# Altium schematic sheet SC2.schdoc: TEBF0808 - CPLD_2
size A4; DocumentNumber: TEBF0808; Revision: 04; SheetNumber: 27; SheetTotal: 36; Date: 2016-09-29; CompanyName: Trenz Electronic GmbH; Organization: Trenz Electronic GmbH
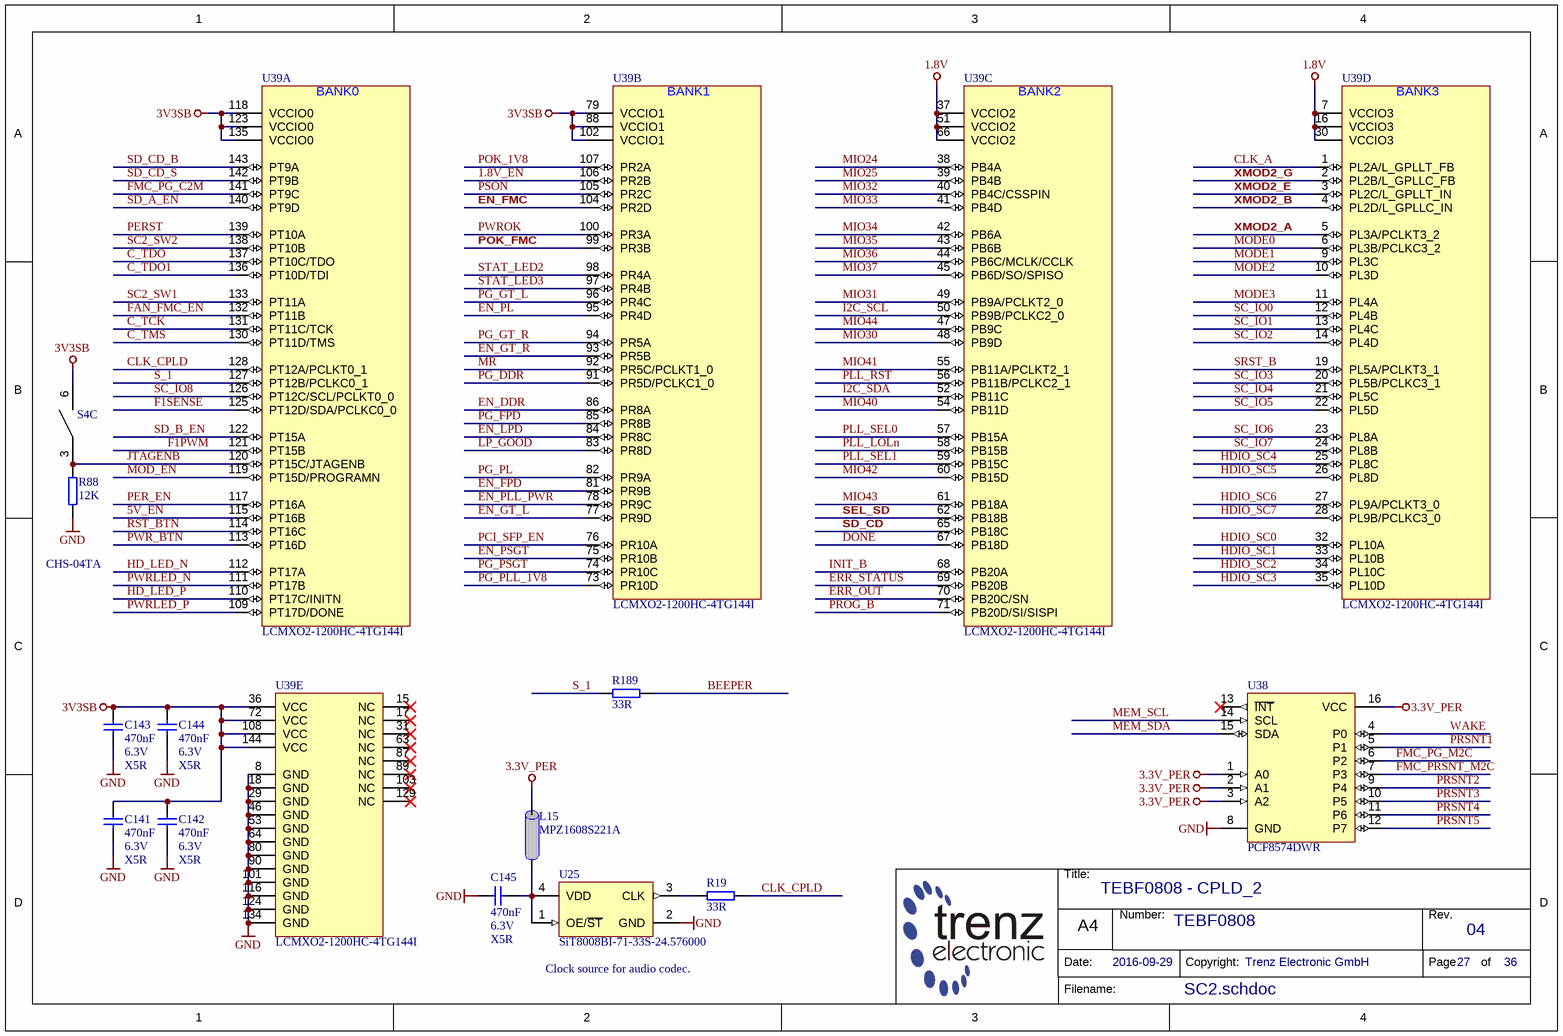
[diagram p0: SC2.schdoc]

## Parts
C141  470nF  Voltage: 6.3V  Technology: X5R  [CAPC1005X55N]
C142  470nF  Voltage: 6.3V  Technology: X5R  [CAPC1005X55N]
C143  470nF  Voltage: 6.3V  Technology: X5R  [CAPC1005X55N]
C144  470nF  Voltage: 6.3V  Technology: X5R  [CAPC1005X55N]
C145  470nF  Voltage: 6.3V  Technology: X5R  [CAPC1005X55N]
L15  MPZ1608S221A  [INDC1608X95N]
R19  33R  [RESC1005X40N]
R88  12K  [RESC1005X40N]
R189  33R  [RESC1005X40N]
S4  CHS-04TA  [CHS-04TA]  (part C of 4)
U25  SiT8008BI-71-33S-24.576000  [2016]
U38  PCF8574DWR  [SOIC127P1030X265-16N]
U39  LCMXO2-1200HC-4TG144I  [QFP50P2200X2200X160-144N]  (parts A,B,C,D,E of 5)

## Nets
1.8V: U39.7(VCCIO3) U39.16(VCCIO3) U39.30(VCCIO3) U39.37(VCCIO2) U39.51(VCCIO2) U39.66(VCCIO2)
3.3V_PER: L15.2 U38.1(A0) U38.2(A1) U38.3(A2) U38.16(VCC)
3V3SB: C141.1 C142.1 C143.1 C144.1 S4.6 U39.36(VCC) U39.72(VCC) U39.79(VCCIO1) U39.88(VCCIO1) U39.102(VCCIO1) U39.108(VCC) U39.118(VCCIO0) U39.123(VCCIO0) U39.135(VCCIO0) U39.144(VCC)
GND: C141.2 C142.2 C143.2 C144.2 C145.2 R88.1 U25.2(GND) U38.8(GND) U39.8(GND) U39.18(GND) U39.29(GND) U39.46(GND) U39.53(GND) U39.64(GND) U39.80(GND) U39.90(GND) U39.101(GND) U39.116(GND) U39.124(GND) U39.134(GND)
1.8V_EN: U39.106(PR2B)
5V_EN: U39.115(PT16B)
BEEPER: R189.2
C_TCK: U39.131(PT11C/TCK)
C_TDO: U39.137(PT10C/TDO)
C_TDO1: U39.136(PT10D/TDI)
C_TMS: U39.130(PT11D/TMS)
CLK_A: U39.1(PL2A/L_GPLLT_FB)
CLK_CPLD: R19.2 U39.128(PT12A/PCLKT0_1)
DONE: U39.67(PB18D)
EN_DDR: U39.86(PR8A)
EN_FMC: U39.104(PR2D)
EN_FPD: U39.81(PR9B)
EN_GT_L: U39.77(PR9D)
EN_GT_R: U39.93(PR5B)
EN_LPD: U39.84(PR8C)
EN_PL: U39.95(PR4D)
EN_PLL_PWR: U39.78(PR9C)
EN_PSGT: U39.75(PR10B)
ERR_OUT: U39.70(PB20C/SN)
ERR_STATUS: U39.69(PB20B)
F1PWM: U39.121(PT15B)
F1SENSE: U39.125(PT12D/SDA/PCLKC0_0)
FAN_FMC_EN: U39.132(PT11B)
FMC_PG_C2M: U39.141(PT9C)
FMC_PG_M2C: U38.6(P2)
FMC_PRSNT_M2C: U38.7(P3)
HD_LED_N: U39.112(PT17A)
HD_LED_P: U39.110(PT17C/INITN)
HDIO_SC0: U39.32(PL10A)
HDIO_SC1: U39.33(PL10B)
HDIO_SC2: U39.34(PL10C)
HDIO_SC3: U39.35(PL10D)
HDIO_SC4: U39.25(PL8C)
HDIO_SC5: U39.26(PL8D)
HDIO_SC6: U39.27(PL9A/PCLKT3_0)
HDIO_SC7: U39.28(PL9B/PCLKC3_0)
I2C_SCL: U39.50(PB9B/PCLKC2_0)
I2C_SDA: U39.52(PB11C)
INIT_B: U39.68(PB20A)
JTAGENB: R88.2 S4.3 U39.120(PT15C/JTAGENB)
LP_GOOD: U39.83(PR8D)
MEM_SCL: U38.14(SCL)
MEM_SDA: U38.15(SDA)
MIO24: U39.38(PB4A)
MIO25: U39.39(PB4B)
MIO30: U39.48(PB9D)
MIO31: U39.49(PB9A/PCLKT2_0)
MIO32: U39.40(PB4C/CSSPIN)
MIO33: U39.41(PB4D)
MIO34: U39.42(PB6A)
MIO35: U39.43(PB6B)
MIO36: U39.44(PB6C/MCLK/CCLK)
MIO37: U39.45(PB6D/SO/SPISO)
MIO40: U39.54(PB11D)
MIO41: U39.55(PB11A/PCLKT2_1)
MIO42: U39.60(PB15D)
MIO43: U39.61(PB18A)
MIO44: U39.47(PB9C)
MOD_EN: U39.119(PT15D/PROGRAMN)
MODE0: U39.6(PL3B/PCLKC3_2)
MODE1: U39.9(PL3C)
MODE2: U39.10(PL3D)
MODE3: U39.11(PL4A)
MR: U39.92(PR5C/PCLKT1_0)
PCI_SFP_EN: U39.76(PR10A)
PER_EN: U39.117(PT16A)
PERST: U39.139(PT10A)
PG_DDR: U39.91(PR5D/PCLKC1_0)
PG_FPD: U39.85(PR8B)
PG_GT_L: U39.96(PR4C)
PG_GT_R: U39.94(PR5A)
PG_PL: U39.82(PR9A)
PG_PLL_1V8: U39.73(PR10D)
PG_PSGT: U39.74(PR10C)
PLL_LOLn: U39.58(PB15B)
PLL_RST: U39.56(PB11B/PCLKC2_1)
PLL_SEL0: U39.57(PB15A)
PLL_SEL1: U39.59(PB15C)
POK_1V8: U39.107(PR2A)
POK_FMC: U39.99(PR3B)
PROG_B: U39.71(PB20D/SI/SISPI)
PRSNT1: U38.5(P1)
PRSNT2: U38.9(P4)
PRSNT3: U38.10(P5)
PRSNT4: U38.11(P6)
PRSNT5: U38.12(P7)
PSON: U39.105(PR2C)
PWR_BTN: U39.113(PT16D)
PWRLED_N: U39.111(PT17B)
PWRLED_P: U39.109(PT17D/DONE)
PWROK: U39.100(PR3A)
RST_BTN: U39.114(PT16C)
S_1: R189.1 U39.127(PT12B/PCLKC0_1)
SC2_SW1: U39.133(PT11A)
SC2_SW2: U39.138(PT10B)
SC_IO0: U39.12(PL4B)
SC_IO1: U39.13(PL4C)
SC_IO2: U39.14(PL4D)
SC_IO3: U39.20(PL5B/PCLKC3_1)
SC_IO4: U39.21(PL5C)
SC_IO5: U39.22(PL5D)
SC_IO6: U39.23(PL8A)
SC_IO7: U39.24(PL8B)
SC_IO8: U39.126(PT12C/SCL/PCLKT0_0)
SD_A_EN: U39.140(PT9D)
SD_B_EN: U39.122(PT15A)
SD_CD: U39.65(PB18C)
SD_CD_B: U39.143(PT9A)
SD_CD_S: U39.142(PT9B)
SEL_SD: U39.62(PB18B)
SRST_B: U39.19(PL5A/PCLKT3_1)
STAT_LED2: U39.98(PR4A)
STAT_LED3: U39.97(PR4B)
WAKE: U38.4(P0)
XMOD2_A: U39.5(PL3A/PCLKT3_2)
XMOD2_B: U39.4(PL2D/L_GPLLC_IN)
XMOD2_E: U39.3(PL2C/L_GPLLT_IN)
XMOD2_G: U39.2(PL2B/L_GPLLC_FB)
NetC145_1: C145.1 L15.1 U25.1(OE/~{ST}) U25.4(VDD)
NetR19_1: R19.1 U25.3(CLK)

Not connected (* = marked no-connect by the designer): U38 13(~{INT})*; U39 15(NC)* 17(NC)* 31(NC)* 63(NC)* 87(NC)* 89(NC)* 103(NC)* 129(NC)*

## Notes on the sheet
- (near U25) Clock source for audio codec.
- Title:
- Number:
- Rev.
- Date:
- A4
- Copyright:
- Page
- of
- Filename:
- (in symbol 25915, part A) BANK0
- (in symbol 25915, part B) BANK1
- (in symbol 25915, part C) BANK2
- (in symbol 25915, part D) BANK3

## Library data of the parts
C141-C144 = 23659: KON 470nF 6,3V X5R SMD; AN: 23659; Mixed: SMT; Value: 470n; Preferred: Yes; Case: 1005 (0402)
C145 = 23659: KON 470nF 6,3V X5R SMD; AN: 23659; Value: 470n; Mixed: SMT; Preferred: Yes; Case: 1005 (0402)
L15 = 22718: Ferritdurchführung MPZ1608S221A; AN: 22718; Mixed: SMT; Trenz-Stock: Yes; Value: 220 OHm @ 100MHz; Case: 1608 (0603); HelpURL: B:\AD\adlib\datasheet\MPZ1608; Preferred: Yes; H-ART: MPZ1608S221A
R19 R189 = 22770: WID SMD 33R 1% 0,063W; AN: 22770; Mixed: SMT; Value: 33; Preferred: Yes; Tolerance: 1%; Case: 1005 (0402); Technology: TK100
R88 = 22598: WID SMD 12K 1% 0,063W; AN: 22598; Mixed: SMT; Preferred: Yes; Tolerance: 1%; Case: 1005 (0402); Technology: TK100; Value: 12K
S4 = 23417: DIP Schalter 4 fach 1,27mm SMD; AN: 23417; Mixed: SMT; Trenz-Stock: Yes; HelpURL: B:\AD\adlib\datasheet\CHS; Preferred: Yes; H-ART: CHS-04TA
U25 = 27547: SiT8008BI-71-33S-24.576000 MEMS Oszillator 24.576000MHz; AN: 27547; Mixed: SMT; Trenz-Stock: Yes; Value: 24.576M; Case: 2.0  x 1.6mm; HelpURL: B:\AD\adlib\datasheet\SiT8008; Preferred: Yes; H-ART: SiT8008BI-71-33S-24.576000
U38 = 26502: AN: 26502; Mixed: SMT; Case: SO16W DW; HelpURL: B:\AD\adlib\datasheet\PCF8574; H-ART: PCF8574DWR
U39 = 25915: AN: 25915; Mixed: SMT; Trenz-Stock: Yes; Case: TQFP144; HelpURL: B:\AD\adlib\datasheet\MachXO2; H-ART: LCMXO2-1200HC-4TG144I